# Altium schematic sheet CP2102N_USB-to-UART_Bridge.SchDoc: CP2102 USB-to-UART Bridge
size A4
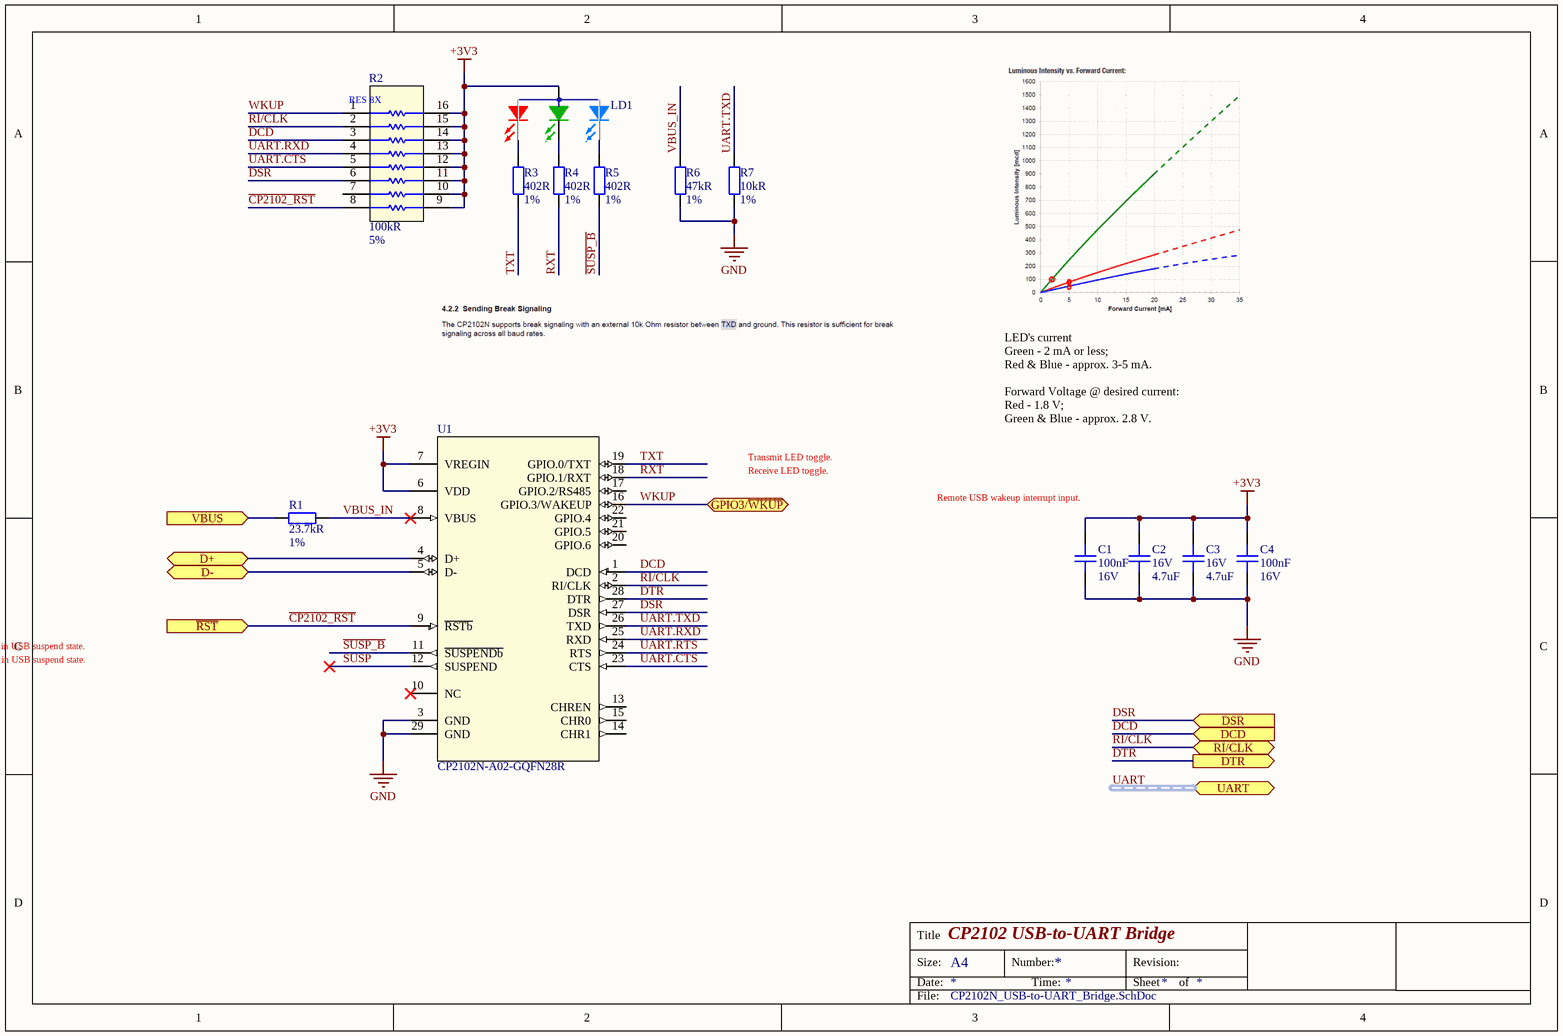
[diagram p0: CP2102N_USB-to-UART_Bridge.SchDoc]

## Parts
C1  Capacitance: 100nF  Voltage: 16V  [C0402]  (hidden comment: CAP CER 0.1UF 16V X7R 0402)
C2  Voltage Rating: 16V  Capacitance: 4.7uF  [C0603]  (hidden comment: CAP CER 4.7UF 16V X5R 0603)
C3  Voltage Rating: 16V  Capacitance: 4.7uF  [C0603]  (hidden comment: CAP CER 4.7UF 16V X5R 0603)
C4  Capacitance: 100nF  Voltage: 16V  [C0402]  (hidden comment: CAP CER 0.1UF 16V X7R 0402)
LD1  150066M153000  [LED_0606_RGB_WURTH]  (value not drawn)
R1  Resistance: 23.7kR  Tolerance: 1%  [R0402]  (hidden comment: RES SMD 23.7K OHM 1% 1/16W 0402)
R2  Resistance: 100kR  Tolerance: 5%  [YAG_YC248]  (hidden comment: RES ARRAY 8 RES 100K OHM 1606)
R3  Resistance: 402R  Tolerance: 1%  [R0402]  (hidden comment: RES SMD 402 OHM 1% 1/16W 0402)
R4  Resistance: 402R  Tolerance: 1%  [R0402]  (hidden comment: RES SMD 402 OHM 1% 1/16W 0402)
R5  Resistance: 402R  Tolerance: 1%  [R0402]  (hidden comment: RES SMD 402 OHM 1% 1/16W 0402)
R6  Resistance: 47kR  Tolerance: 1%  [R0402]  (hidden comment: RES SMD 47K OHM 1% 1/16W 0402)
R7  Resistance: 10kR  Tolerance: 1%  [R0402]  (hidden comment: RES SMD 10K OHM 1% 1/16W 0402)
U1  CP2102N-A02-GQFN28R  [QFN28_5X5]

## Ports
D+ (bidir), D- (bidir), DCD (in), DSR (in), DTR (out), GPIO3/~{WKUP} (bidir), RI/CLK (bidir), UART (harness UART), VBUS (in), ~{RST} (in)

## Nets
+3V3: C1.2 C2.2 C3.2 C4.2 LD1.A R2.9 R2.10 R2.11 R2.12 R2.13 R2.14 R2.15 R2.16 U1.6(VDD) U1.7(VREGIN)
GND: C1.1 C2.1 C3.1 C4.1 R6.2 R7.1 U1.3(GND) U1.29(GND)
~{CP2102_RST}: R2.8 U1.9(~{RSTb}) ; port ~{RST}
~{SUSP_B}: R5.1 U1.11(~{SUSPENDb})
D+: U1.4(D+) ; port D+
D-: U1.5(D-) ; port D-
DCD: R2.3 U1.1(DCD) ; port DCD
DSR: R2.6 U1.27(DSR) ; port DSR
DTR: U1.28(DTR) ; port DTR
RI/CLK: R2.2 U1.2(RI/CLK) ; port RI/CLK
RXT: R4.1 U1.18(GPIO.1/RXT)
SUSP: U1.12(SUSPEND)
TXT: R3.1 U1.19(GPIO.0/TXT)
UART.CTS: R2.5 U1.23(CTS)
UART.RTS: U1.24(RTS)
UART.RXD: R2.4 U1.25(RXD)
UART.TXD: R7.2 U1.26(TXD)
VBUS: R1.2 ; port VBUS
VBUS_IN: R1.1 R6.1 U1.8(VBUS)
WKUP: R2.1 U1.16(GPIO.3/WAKEUP) ; port GPIO3/~{WKUP}
NetLD1_BK: LD1.BK R5.2
NetLD1_GK: LD1.GK R4.2
NetLD1_RK: LD1.RK R3.2

Not connected (* = marked no-connect by the designer): R2 7(17); U1 10(NC)* 13(CHREN) 14(CHR1) 15(CHR0) 17(GPIO.2/RS485) 20(GPIO.6) 21(GPIO.5) 22(GPIO.4)

## Buses and harness runs
harness UART = port UART

## Notes on the sheet
- LED's current
  Green - 2 mA or less;
  Red & Blue - approx. 3-5 mA.
  Forward Voltage @ desired current:
  Red - 1.8 V;
  Green & Blue - approx. 2.8 V.
- Receive LED toggle.
- (near U1) Transmit LED toggle.
- Remote USB wakeup interrupt input.
- (near U1) SUSP_B is driven low while the device is in USB suspend state.
- SUSP is driven high while the device in USB suspend state.
- Title
- Size:
- Date:
- A4
- Number:
- Time:
- Revision:
- Sheet
- of
- File:
- (in symbol RES ARRAY 8 RES 100K OHM 1606) RES 8X

## Library data of the parts
C1 C4 = CAP CER 0.1UF 16V X7R 0402: 0.1µF ±10% 16V Ceramic Capacitor X7R 0402 (1005 Metric); Manufacturer Part Number: CC0402KRX7R7BB104; Manufacturer: Yageo; Revision: July-2002: Re-released for DXP Platform.; Order: CC0402KRX7R7BB104; Supplier 1: Digi-Key; Stock 1: 25916830; Pricing 1: 1=0.1, 10=0.031, 100=0.0136, 500=0.0097, 1000=0.0077, 2500=0.007, 5000=0.0064 (USD); Mount: Surface Mount; Number of Pins: 2; Case Code (Metric): 1005; Case Code (Imperial): 0402; Min Operating Temperature: -55°C; Max Operating Temperature: 125°C; Tolerance: 10%; Dielectric: X7R; Voltage Rating: 16V; Voltage Rating (DC): 16V; Packaging: Tape and Reel; Package Quantity: 1; Termination: SMD/SMT; Composition: Ceramic; Length: 1mm; Height: 0.5mm; Width: 0.02inch; Thickness: 0.022inch; Depth: 0.5mm; Radiation Hardening: No; REACH SVHC: No SVHC; Lead Free: Lead Free; Halogen Free: Halogen Free; ComponentLink1URL: http://www.yageo.com/documents/recent/UPY-GPHC_X7R_6.3V-to-50V_8.pdf?src-supplier=Avnet+Europe; ComponentLink1Description: http://www.yageo.com/documents/recent/UPY-GPHC_X7R_6.3V-to-50V_8.pdf?src-supplier=Avnet+Europe; ComponentLink2URL: http://www.yageo.com/documents/recent/UPY-GPHC_X7R_6.3V-to-50V_18.pdf?src-supplier=Digi-Key; ComponentLink2Description: http://www.yageo.com/documents/recent/UPY-GPHC_X7R_6.3V-to-50V_18.pdf?src-supplier=Digi-Key; ComponentLink3URL: http://www.yageo.com/documents/recent/UPY-GPHC_X7R_6.3V-to-50V_8.pdf?src-supplier=Avnet; ComponentLink3Description: http://www.yageo.com/documents/recent/UPY-GPHC_X7R_6.3V-to-50V_8.pdf?src-supplier=Avnet; ComponentLink4URL: http://www.yageo.com/documents/recent/UPY-GPHC_X7R_6.3V-to-50V_18.pdf?src-supplier=Mouser; ComponentLink4Description: http://www.yageo.com/documents/recent/UPY-GPHC_X7R_6.3V-to-50V_18.pdf?src-supplier=Mouser; ComponentLink5URL: http://www.farnell.com/datasheets/2167236.pdf?src-supplier=Element14; ComponentLink5Description: http://www.farnell.com/datasheets/2167236.pdf?src-supplier=Element14; ComponentLink6URL: http://www.farnell.com/datasheets/1489800.pdf?src-supplier=Element14; ComponentLink6Description: http://www.farnell.com/datasheets/1489800.pdf?src-supplier=Element14; Supplier Part Number 1: 311-1338-1-ND
C2 C3 = CAP CER 4.7UF 16V X5R 0603: 4.7µF ±10% 16V Ceramic Capacitor X5R 0603 (1608 Metric); Manufacturer: Yageo; Manufacturer Part Number: CC0603KRX5R7BB475; Supplier 1: Digi-Key; Stock 1: 332229; Pricing 1: 1=0.5, 10=0.355, 50=0.2688, 100=0.2341 (USD); Mount: Surface Mount; Case/Package: 0603; Weight: 7.1E-05oz; Case Code (Metric): 1608; Case Code (Imperial): 0603; Min Operating Temperature: -55°C; Max Operating Temperature: 85°C; Tolerance: 10%; Packaging: Tape and Reel; Voltage Rating (DC): 16V; Dielectric: X5R; Termination: SMD/SMT; Length: 1.6mm; Height: 0.8mm; Width: 0.8mm; Thickness: 0.037inch; Depth: 0.8mm; Lead Free: Lead Free; ComponentLink1URL: http://www.mouser.com/ds/2/447/UPY-GPHC_X5R_4V-to-50V_25-1131599.pdf?src-supplier=Mouser; ComponentLink1Description: http://www.mouser.com/ds/2/447/UPY-GPHC_X5R_4V-to-50V_25-1131599.pdf?src-supplier=Mouser; ComponentLink2URL: http://www.yageo.com/documents/recent/UPY-GPHC_X5R_4V-to-50V_25.pdf?src-supplier=Digi-Key; ComponentLink2Description: http://www.yageo.com/documents/recent/UPY-GPHC_X5R_4V-to-50V_25.pdf?src-supplier=Digi-Key; ComponentLink3URL: http://components.arrow.com/part/dataview/0323_04166500?src-supplier=Arrow+Europe; ComponentLink3Description: http://components.arrow.com/part/dataview/0323_04166500?src-supplier=Arrow+Europe; Supplier Part Number 1: 311-1785-1-ND; Composition: Ceramic; Halogen Free: Halogen Free
LD1 = LED RGB DIFFUSED SMD: Red, Green, Blue (RGB) 624nm Red, 525nm Green, 470nm Blue LED Indication - Discrete 2V Red, 3.3V Green, 3.3V Blue 0606 (1616 Metric); Manufacturer: Wurth Electronics; Color: Blue,Green,Red; Lens Style: Flat; Element Configuration: Common Anode; Luminous Intensity: 180mcd; Test Current: 20mA; Viewing Angle: 120°; Lens Size: 1.6mm; Supplier 1: Digi-Key; Manufacturer Part Number: 150066M153000; Stock 1: 7810; Pricing 1: 1=0.51, 50=0.415, 100=0.298, 500=0.272 (USD); Mount: Surface Mount; Case/Package: 0606; Case Code (Imperial): 0606; Case Code (Metric): 1616; Packaging: Tape and Reel; Lens Transparency: Diffused; Forward Voltage: 3.3V; Dominant Wavelength: 470nm; Length: 1.6mm; Height: 0.5mm; Width: 1.6mm; ComponentLink1URL: https://katalog.we-online.de/led/datasheet/150066M153000.pdf?src-supplier=Digi-Key; ComponentLink1Description: https://katalog.we-online.de/led/datasheet/150066M153000.pdf?src-supplier=Digi-Key; ComponentLink2URL: http://www.farnell.com/datasheets/2301702.pdf?src-supplier=Farnell; ComponentLink2Description: http://www.farnell.com/datasheets/2301702.pdf?src-supplier=Farnell; ComponentLink3URL: http://www.farnell.com/datasheets/2301702.pdf?src-supplier=Newark; ComponentLink3Description: http://www.farnell.com/datasheets/2301702.pdf?src-supplier=Newark; ComponentLink4URL: http://www.farnell.com/datasheets/2301702.pdf?src-supplier=Element14; ComponentLink4Description: http://www.farnell.com/datasheets/2301702.pdf?src-supplier=Element14; Supplier Part Number 1: 732-11390-1-ND
R1 = RES SMD 23.7K OHM 1% 1/16W 0402: 23.7 kOhms ±1% 0.063W, 1/16W Chip Resistor 0402 (1005 Metric) Moisture Resistant Thick Film; Manufacturer: Yageo; Manufacturer Part Number: RC0402FR-0723K7L; Power Rating: 62.5mW; Voltage Rating: 50V; Max Power Dissipation: 63mW; Temperature Coefficient: 100ppm/°C; Supplier 1: Digi-Key; Stock 1: 58499; Pricing 1: 1=0.1, 10=0.016, 100=0.0064, 1000=0.0029, 2500=0.0025, 5000=0.0021 (USD); Case/Package: 0402; Weight: 2.3E-05oz; Case Code (Imperial): 0402; Case Code (Metric): 1005; Contact Plating: Tin,Matte; Min Operating Temperature: -55°C; Max Operating Temperature: 155°C; Packaging: Tape and Reel; Composition: Thick Film; Number of Terminations: 2; Termination: SMD/SMT; Military Standard: Not; Voltage Rating (DC): 50V; Features: Moisture Resistant; Length: 1mm; Height: 0.016inch; Width: 0.02inch; Depth: 0.5mm; Radiation Hardening: No; Lead Free: Lead Free; ComponentLink1URL: http://www.yageo.com/documents/recent/PYu-RC0402_51_RoHS_L_6.pdf?src-supplier=Avnet+Europe; ComponentLink1Description: http://www.yageo.com/documents/recent/PYu-RC0402_51_RoHS_L_6.pdf?src-supplier=Avnet+Europe; ComponentLink2URL: https://www.verical.com/server-webapp/html/getDatasheet?partID=325115&src-supplier=Verical; ComponentLink2Description: https://www.verical.com/server-webapp/html/getDatasheet?partID=325115&src-supplier=Verical; ComponentLink3URL: http://www.mouser.com/ds/2/447/PYu-RC0402_51_RoHS_L_6_r-8721.pdf?src-supplier=Mouser; ComponentLink3Description: http://www.mouser.com/ds/2/447/PYu-RC0402_51_RoHS_L_6_r-8721.pdf?src-supplier=Mouser; ComponentLink4URL: http://www.yageo.com/documents/recent/PYu-RC0402_51_RoHS_L_6.pdf?src-supplier=Avnet; ComponentLink4Description: http://www.yageo.com/documents/recent/PYu-RC0402_51_RoHS_L_6.pdf?src-supplier=Avnet; Supplier Part Number 1: YAG3067CT-ND; Mount: Surface Mount
R2 = RES ARRAY 8 RES 100K OHM 1606: 100k Ohm ±5% 62.5mW Power Per Element Isolated  Resistor Network/Array ±200ppm/°C 1606, Convex, Long Side Terminals; Manufacturer: Yageo; Manufacturer Part Number: YC248-JR-07100KL; Number of Resistors: 8; Number of Contacts: 16; Voltage Rating: 50V; Supplier 1: Digi-Key; Stock 1: 5800; Pricing 1: 1=0.3, 10=0.251, 25=0.1828, 50=0.1324, 100=0.0982, 250=0.0754, 500=0.0594, 1000=0.0411 (USD); Mount: Surface Mount; Case/Package: 0616; Number of Pins: 16; Number of Terminals: 16; Case Code (Metric): 1640; Case Code (Imperial): 0616; Min Operating Temperature: -55°C; Max Operating Temperature: 155°C; Temperature Coefficient: 200ppm/°C; Power Rating: 62.5mW; Number of Circuits: 8; Number of Elements: 8; Package Quantity: 1; Packaging: Tape and Reel; Circuit Type: Isolated; Power Per Element: 62.5mW; Military Standard: Not; Termination: Convex; Length: 0.157inch; Height: 0.022inch; Width: 0.063inch; Terminal Pitch: 0.5mm; Depth: 1.6mm; REACH SVHC: No SVHC; Lead Free: Lead Free; ComponentLink1URL: https://media.digikey.com/pdf/Data%20Sheets/Yageo%20PDFs/YC102-358,TC122-164_Series_DS.pdf?src-supplier=Digi-Key; ComponentLink1Description: https://media.digikey.com/pdf/Data%20Sheets/Yageo%20PDFs/YC102-358,TC122-164_Series_DS.pdf?src-supplier=Digi-Key; ComponentLink2URL: http://www.yageo.com/documents/recent/PYu-YC248_51_RoHS_L_2.pdf?src-supplier=Digi-Key; ComponentLink2Description: http://www.yageo.com/documents/recent/PYu-YC248_51_RoHS_L_2.pdf?src-supplier=Digi-Key; ComponentLink3URL: http://www.yageo.com/NewPortal/yageodocoutput?fileName=/pdf/R-Chip/PYu-YC_TC_group_51_RoHS_L_0.pdf&src-supplier=Digi-Key; ComponentLink3Description: http://www.yageo.com/NewPortal/yageodocoutput?fileName=/pdf/R-Chip/PYu-YC_TC_group_51_RoHS_L_0.pdf&src-supplier=Digi-Key; ComponentLink4URL: http://www.yageo.com/documents/recent/PYu-YC248_51_RoHS_L_(2).pdf?src-supplier=Avnet+Europe; ComponentLink4Description: http://www.yageo.com/documents/recent/PYu-YC248_51_RoHS_L_(2).pdf?src-supplier=Avnet+Europe; Supplier Part Number 1: YC248J-100KCT-ND; Voltage Rating (DC): 50V; Composition: Thick Film; Radiation Hardening: No; ComponentLink5URL: http://www.farnell.com/datasheets/443139.pdf?src-supplier=Element14; ComponentLink5Description: http://www.farnell.com/datasheets/443139.pdf?src-supplier=Element14
R3-R5 = RES SMD 402 OHM 1% 1/16W 0402: 402 Ohms ±1% 0.063W, 1/16W Chip Resistor 0402 (1005 Metric) Moisture Resistant Thick Film; Manufacturer: Yageo; Manufacturer Part Number: RC0402FR-07402RL; Power Rating: 62.5mW; Voltage Rating: 50V; Temperature Coefficient: 100ppm/°C; Max Power Dissipation: 63mW; Supplier 1: Digi-Key; Stock 1: 0; Pricing 1: 1=0.1, 10=0.016, 100=0.0064, 1000=0.0029, 2500=0.0025, 5000=0.0021 (USD); Case/Package: 0402; Case Code (Imperial): 0402; Case Code (Metric): 1005; Contact Plating: Tin,Matte; Min Operating Temperature: -55°C; Max Operating Temperature: 155°C; Packaging: Tape and Reel; Composition: Thick Film; Number of Terminations: 2; Termination: SMD/SMT; Military Standard: Not; Features: Moisture Resistant; Length: 0.039inch; Height: 0.016inch; Width: 0.02inch; Depth: 0.5mm; Lead Free: Lead Free; ComponentLink1URL: http://www.yageo.com/documents/recent/PYu-RC0402_51_RoHS_L_6.pdf?src-supplier=Avnet; ComponentLink1Description: http://www.yageo.com/documents/recent/PYu-RC0402_51_RoHS_L_6.pdf?src-supplier=Avnet; ComponentLink2URL: http://www.yageo.com/documents/recent/PYu-RC0402_51_RoHS_L_6.pdf?src-supplier=Avnet+Europe; ComponentLink2Description: http://www.yageo.com/documents/recent/PYu-RC0402_51_RoHS_L_6.pdf?src-supplier=Avnet+Europe; ComponentLink3URL: http://www.mouser.com/ds/2/447/PYu-RC0402_51_RoHS_L_6_r-8721.pdf?src-supplier=Mouser; ComponentLink3Description: http://www.mouser.com/ds/2/447/PYu-RC0402_51_RoHS_L_6_r-8721.pdf?src-supplier=Mouser; Supplier Part Number 1: YAG3152CT-ND; Mount: Surface Mount
R6 = RES SMD 47K OHM 1% 1/16W 0402: 47 kOhms ±1% 0.063W, 1/16W Chip Resistor 0402 (1005 Metric) Moisture Resistant Thick Film; Manufacturer Part Number: RC0402FR-0747KL; Manufacturer: Yageo; Temperature Coefficient: 100ppm/°C; Voltage Rating: 50V; Power Rating: 62.5mW; Max Power Dissipation: 63mW; Supplier 1: Digi-Key; Stock 1: 0; Pricing 1: 1=0.1, 10=0.015, 100=0.0062, 1000=0.0028, 2500=0.0024, 5000=0.002 (USD); Case Code (Imperial): 0402; Case Code (Metric): 1005; Min Operating Temperature: -55°C; Max Operating Temperature: 155°C; Composition: Thick Film; Packaging: Tape and Reel; Termination: SMD/SMT; Military Standard: Not; Number of Terminations: 2; Length: 1mm; Height: 0.016inch; Width: 0.5mm; Depth: 0.5mm; REACH SVHC: Unknown; Lead Free: Lead Free; ComponentLink1URL: http://www.yageo.com/documents/recent/PYu-RC0402_51_RoHS_L_6_r.pdf?src-supplier=Future+Electronics; ComponentLink1Description: http://www.yageo.com/documents/recent/PYu-RC0402_51_RoHS_L_6_r.pdf?src-supplier=Future+Electronics; ComponentLink2URL: http://www.farnell.com/datasheets/1018594.pdf?src-supplier=Element14; ComponentLink2Description: http://www.farnell.com/datasheets/1018594.pdf?src-supplier=Element14; ComponentLink3URL: https://www.verical.com/server-webapp/html/getDatasheet?partID=323748&src-supplier=Verical; ComponentLink3Description: https://www.verical.com/server-webapp/html/getDatasheet?partID=323748&src-supplier=Verical; ComponentLink4URL: http://www.yageo.com/documents/recent/PYu-RC_Group_51_RoHS_L_10.pdf?src-supplier=Digi-Key; ComponentLink4Description: http://www.yageo.com/documents/recent/PYu-RC_Group_51_RoHS_L_10.pdf?src-supplier=Digi-Key; Supplier Part Number 1: 311-47.0KLRCT-ND; Case/Package: 0402; Package Quantity: 1; Features: Moisture Resistant; Mount: Surface Mount
R7 = RES SMD 10K OHM 1% 1/16W 0402: 10 kOhms ±1% 0.063W, 1/16W Chip Resistor 0402 (1005 Metric) Moisture Resistant Thick Film; Manufacturer Part Number: RC0402FR-0710KP; Manufacturer: Yageo; Temperature Coefficient: 150ppm/°C; Max Power Dissipation: 63mW; Supplier 1: Digi-Key; Stock 1: 839368; Pricing 1: 1=0.1, 10=0.035, 100=0.014, 1000=0.0063, 2500=0.0055, 5000=0.0045 (USD); Case Code (Imperial): 0402; Case Code (Metric): 1005; Min Operating Temperature: -55°C; Max Operating Temperature: 155°C; Composition: Thick Film; Packaging: Tape and Reel; Number of Terminations: 2; Length: 0.039inch; Height: 0.016inch; Width: 0.02inch; ComponentLink1URL: http://www.yageo.com/NewPortal/yageodocoutput?fileName=/pdf/R-Chip/PYu-RC_51_RoHS_P_0.pdf&src-supplier=Digi-Key; ComponentLink1Description: http://www.yageo.com/NewPortal/yageodocoutput?fileName=/pdf/R-Chip/PYu-RC_51_RoHS_P_0.pdf&src-supplier=Digi-Key; Supplier Part Number 1: YAG1249CT-ND; Case/Package: 0402; Features: Moisture Resistant; Mount: Surface Mount
U1 = IC CP2102N USB TO UART BRIDGE QFN28: USB Bridge, USB to UART USB 2.0 UART Interface 28-QFN (5x5); Manufacturer: Silicon Labs; Supplier 1: Digi-Key; Manufacturer Part Number: CP2102N-A02-GQFN28R; Stock 1: 3461; Pricing 1: 1=1.4, 25=1.3516, 100=1.2995 (USD); Supplier Part Number 1: 336-5890-1-ND; ComponentLink1URL: https://4donline.ihs.com/images/VipMasterIC/IC/SILC/SILC-S-A0007770867/SILC-S-A0007770867-1.pdf?hkey=6D3A4C79FDBF58556ACFDE234799DDF0&src-supplier=Farnell; ComponentLink1Description: https://4donline.ihs.com/images/VipMasterIC/IC/SILC/SILC-S-A0007770867/SILC-S-A0007770867-1.pdf?hkey=6D3A4C79FDBF58556ACFDE234799DDF0&src-supplier=Farnell; Mount: Surface Mount